# Altium schematic sheet EVK-IRIS-W1-PIN-HEADERS_SDIO-HEADER.SchDoc
size A3; DocumentNumber: 13; SheetNumber: 13; SheetTotal: 14
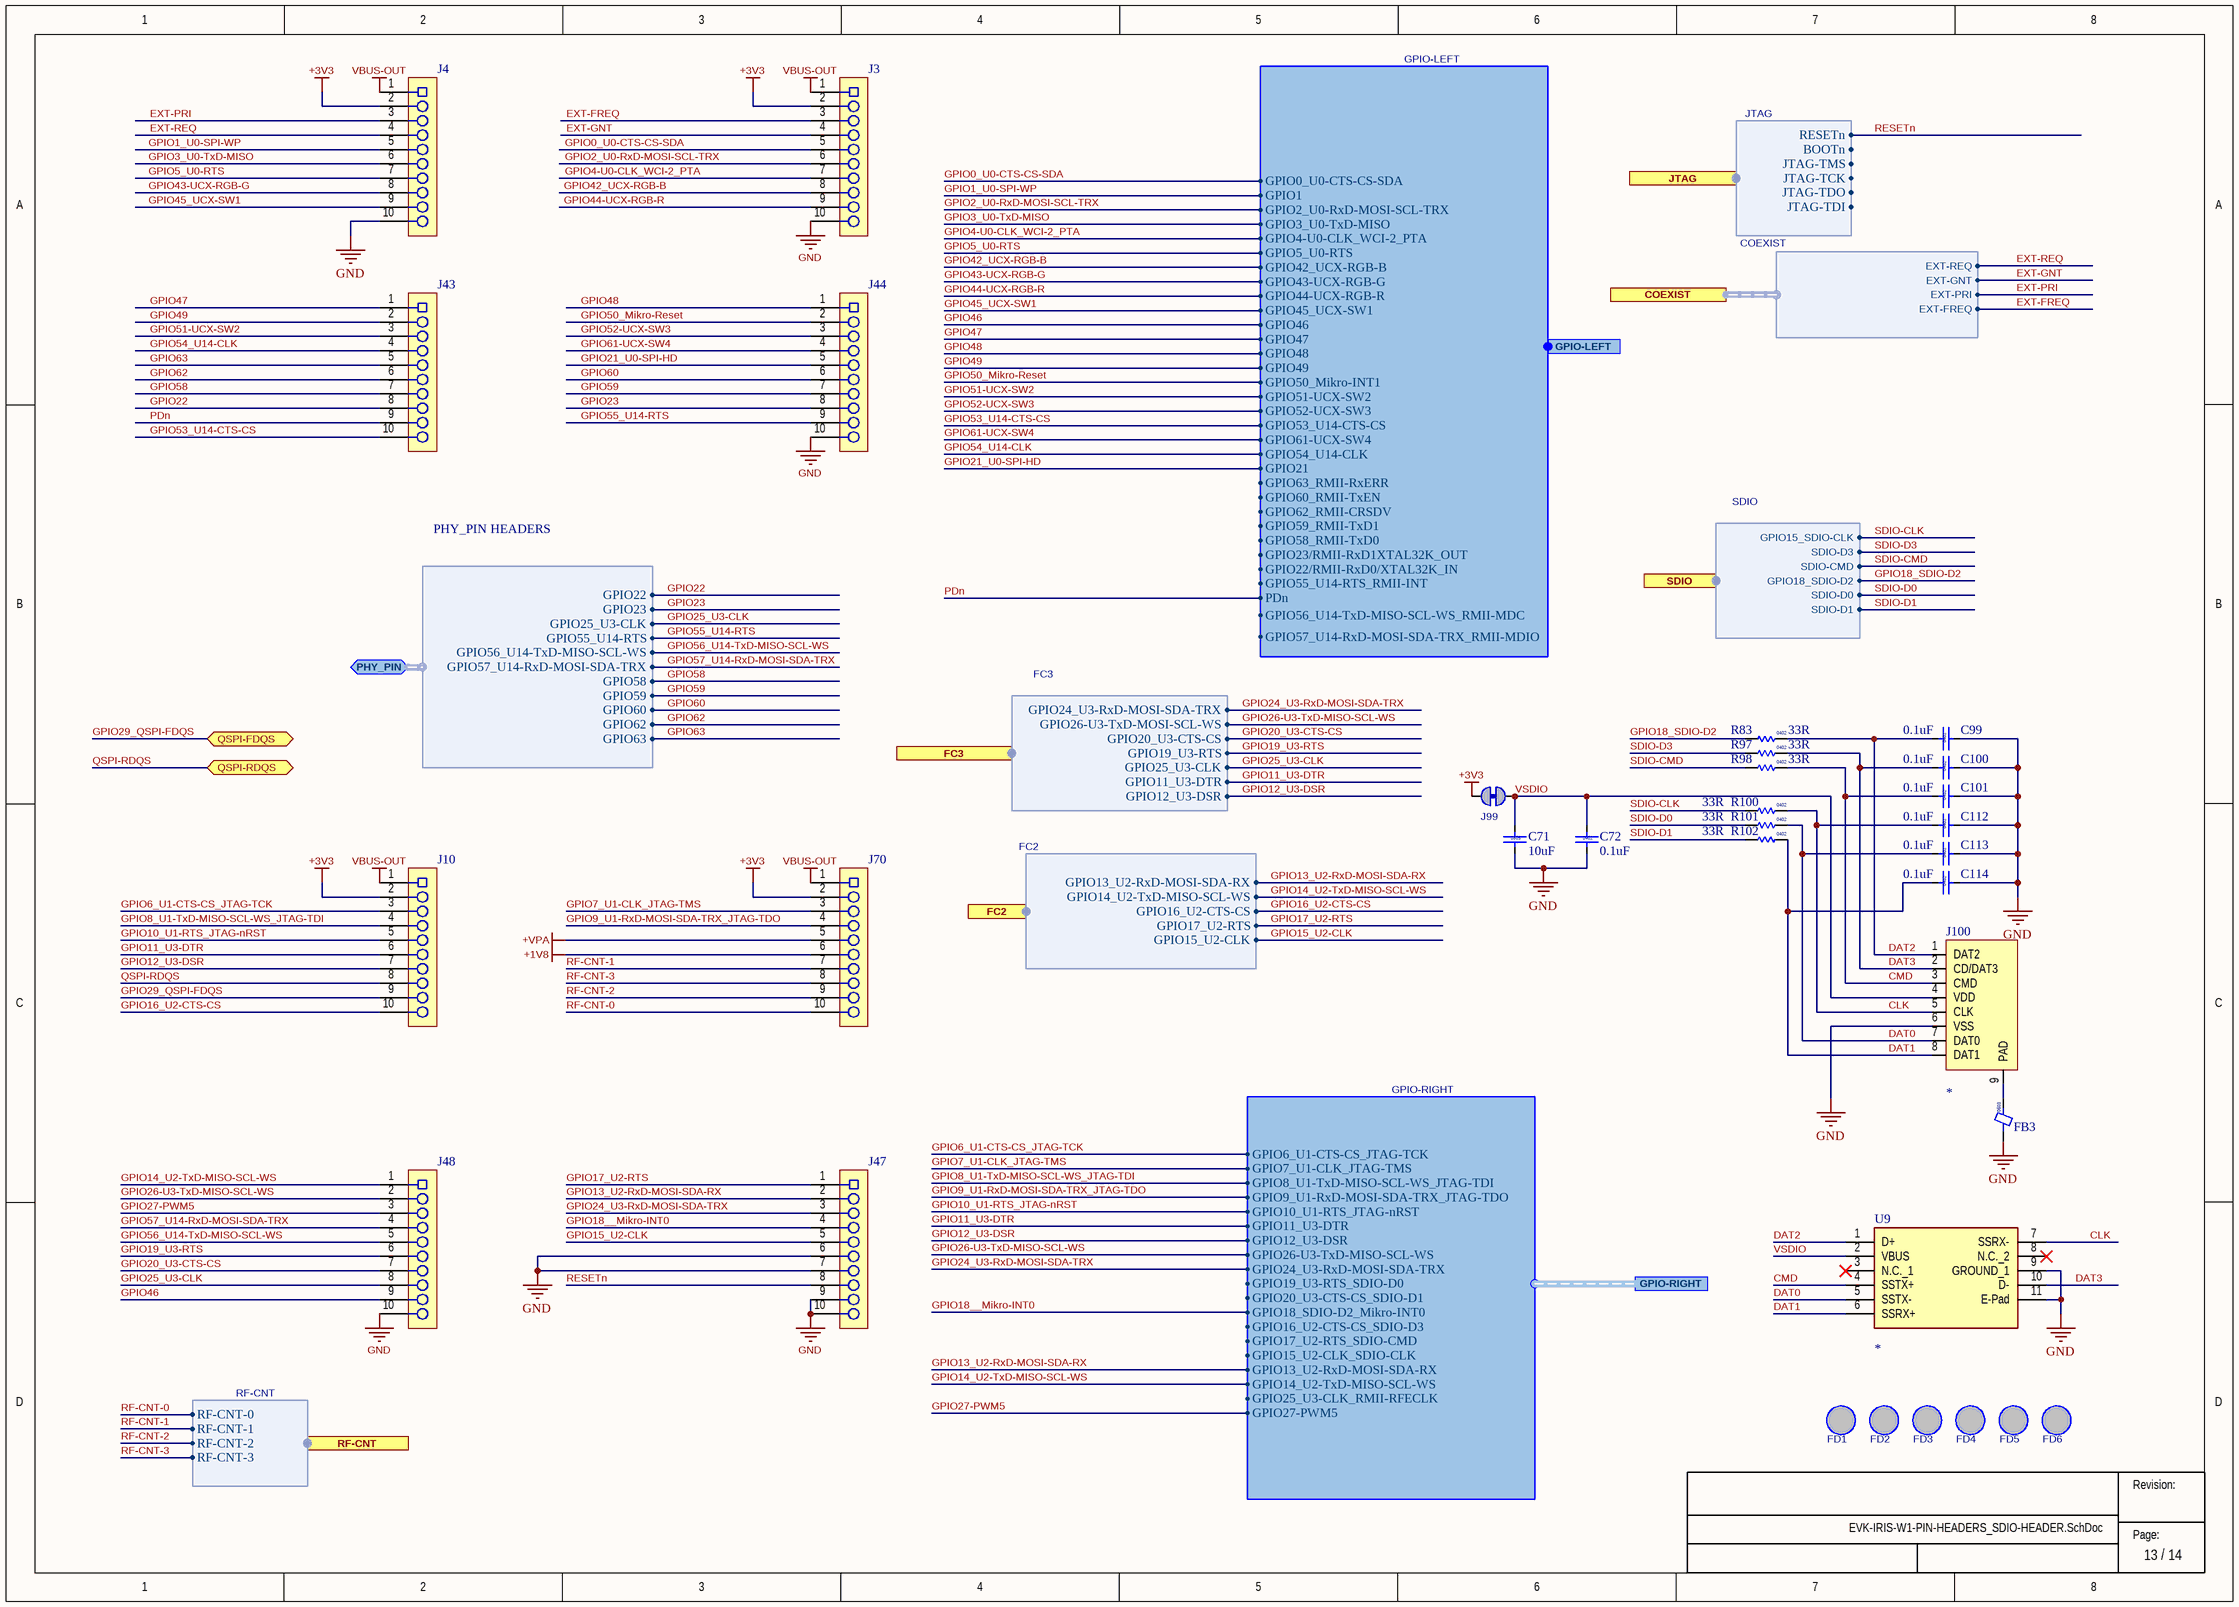
[diagram p0: EVK-IRIS-W1-PIN-HEADERS_SDIO-HEADER.SchDoc]

## Parts
C71  value 10uF  Size: 0805  [Cap 0805 HD]
C72  value 0.1uF  Size: 0402  [Cap 0402 HD]
C99  value 0.1uF  Size: 0402  [Cap 0402 HD]
C100  value 0.1uF  Size: 0402  [Cap 0402 HD]
C101  value 0.1uF  Size: 0402  [Cap 0402 HD]
C112  value 0.1uF  Size: 0402  [Cap 0402 HD]
C113  value 0.1uF  Size: 0402  [Cap 0402 HD]
C114  value 0.1uF  Size: 0402  [Cap 0402 HD]
FB3  Size: 0603  [BLM18EG221SN1]
FD1  Fiducial_1mmDNP  [Fiducial 1mm - Circle]  (value not drawn)  (no BOM)
FD2  Fiducial_1mmDNP  [Fiducial 1mm - Circle]  (value not drawn)  (no BOM)
FD3  Fiducial_1mmDNP  [Fiducial 1mm - Circle]  (value not drawn)  (no BOM)
FD4  Fiducial_1mmDNP  [Fiducial 1mm - Circle]  (value not drawn)  (no BOM)
FD5  Fiducial_1mmDNP  [Fiducial 1mm - Circle]  (value not drawn)  (no BOM)
FD6  Fiducial_1mmDNP  [Fiducial 1mm - Circle]  (value not drawn)  (no BOM)
J3  (no value)  [HDR-0.1P-10PIN-10x1-TH]
J4  (no value)  [HDR-0.1P-10PIN-10x1-TH]
J10  (no value)  [HDR-0.1P-10PIN-10x1-TH]
J43  (no value)  [HDR-0.1P-10PIN-10x1-TH]
J44  (no value)  [HDR-0.1P-10PIN-10x1-TH]
J47  (no value)  [HDR-0.1P-10PIN-10x1-TH]
J48  (no value)  [HDR-0.1P-10PIN-10x1-TH]
J70  (no value)  [HDR-0.1P-10PIN-10x1-TH]
J99  Solderbridge-ShortDNP  [Solderbridge-Short]  (value not drawn)  (net tie, no BOM)
J100  (no value)  [Micro_SD_SKT_SMT_RA]
R83  value 33R  Size: 0402  [RES 0402 HD]
R97  value 33R  Size: 0402  [RES 0402 HD]
R98  value 33R  Size: 0402  [RES 0402 HD]
R100  value 33R  Size: 0402  [RES 0402 HD]
R101  value 33R  Size: 0402  [RES 0402 HD]
R102  value 33R  Size: 0402  [RES 0402 HD]
U9  (no value)  [DFN10]

## Ports
COEXIST (harness COEXIST), FC2 (harness FC2), FC3 (harness FC3), GPIO-LEFT (harness GPIO-LEFT), GPIO-RIGHT (harness GPIO-RIGHT), JTAG (harness JTAG), PHY_PIN (bidir, harness PHY_PIN HEADERS), QSPI-FDQS (bidir), QSPI-RDQS (bidir), RF-CNT (harness RF-CNT), SDIO (harness SDIO)

## Harnesses
GPIO-RIGHT: GPIO6_U1-CTS-CS_JTAG-TCK, GPIO7_U1-CLK_JTAG-TMS, GPIO8_U1-TxD-MISO-SCL-WS_JTAG-TDI, GPIO9_U1-RxD-MOSI-SDA-TRX_JTAG-TDO, GPIO10_U1-RTS_JTAG-nRST, GPIO11_U3-DTR, GPIO12_U3-DSR, GPIO26-U3-TxD-MISO-SCL-WS, GPIO24_U3-RxD-MOSI-SDA-TRX, GPIO19_U3-RTS_SDIO-D0, GPIO20_U3-CTS-CS_SDIO-D1, GPIO18_SDIO-D2_Mikro-INT0, GPIO16_U2-CTS-CS_SDIO-D3, GPIO17_U2-RTS_SDIO-CMD, GPIO15_U2-CLK_SDIO-CLK, GPIO13_U2-RxD-MOSI-SDA-RX, GPIO14_U2-TxD-MISO-SCL-WS, GPIO25_U3-CLK_RMII-RFECLK, GPIO27-PWM5
RF-CNT: RF-CNT-0, RF-CNT-1, RF-CNT-2, RF-CNT-3
GPIO-LEFT: GPIO0_U0-CTS-CS-SDA, GPIO1, GPIO2_U0-RxD-MOSI-SCL-TRX, GPIO3_U0-TxD-MISO, GPIO4-U0-CLK_WCI-2_PTA, GPIO5_U0-RTS, GPIO42_UCX-RGB-B, GPIO43-UCX-RGB-G, GPIO44-UCX-RGB-R, GPIO45_UCX-SW1, GPIO46, GPIO47, GPIO48, GPIO49, GPIO50_Mikro-INT1, GPIO51-UCX-SW2, GPIO52-UCX-SW3, GPIO53_U14-CTS-CS, GPIO61-UCX-SW4, GPIO54_U14-CLK, GPIO21, GPIO63_RMII-RxERR, GPIO60_RMII-TxEN, GPIO62_RMII-CRSDV, GPIO59_RMII-TxD1, GPIO58_RMII-TxD0, GPIO23/RMII-RxD1XTAL32K_OUT, GPIO22/RMII-RxD0/XTAL32K_IN, GPIO55_U14-RTS_RMII-INT, PDn, GPIO56_U14-TxD-MISO-SCL-WS_RMII-MDC, GPIO57_U14-RxD-MOSI-SDA-TRX_RMII-MDIO
COEXIST: EXT-REQ, EXT-GNT, EXT-PRI, EXT-FREQ
SDIO: GPIO15_SDIO-CLK, SDIO-D3, SDIO-CMD, GPIO18_SDIO-D2, SDIO-D0, SDIO-D1
JTAG: JTAG-TCK, JTAG-TDI, JTAG-TDO, JTAG-TMS, BOOTn, RESETn
PHY_PIN HEADERS: GPIO22, GPIO23, GPIO25_U3-CLK, GPIO55_U14-RTS, GPIO56_U14-TxD-MISO-SCL-WS, GPIO57_U14-RxD-MOSI-SDA-TRX, GPIO58, GPIO59, GPIO60, GPIO62, GPIO63
FC2: GPIO13_U2-RxD-MOSI-SDA-RX, GPIO14_U2-TxD-MISO-SCL-WS, GPIO16_U2-CTS-CS, GPIO17_U2-RTS, GPIO15_U2-CLK
FC3: GPIO20_U3-CTS-CS, GPIO19_U3-RTS, GPIO24_U3-RxD-MOSI-SDA-TRX, GPIO26-U3-TxD-MOSI-SCL-WS, GPIO25_U3-CLK, GPIO11_U3-DTR, GPIO12_U3-DSR

## Nets
+1V8: J70.6
+3V3: J3.2 J4.2 J10.2 J70.2 J99.1
+VPA: J70.5
GND: C71.2 C72.2 C99.2 C100.2 C101.2 C112.2 C113.2 C114.2 FB3.1 J3.10 J4.10 J44.10 J47.6 J47.7 J47.9 J47.10 J48.10 J100.6(VSS) U9.9(GROUND_1) U9.11(E-Pad)
VBUS-OUT: J3.1 J4.1 J10.1 J70.1
CLK: C112.1 J100.5(CLK) R100.2 U9.7(SSRX-)
CMD: C101.1 J100.3(CMD) R98.2 U9.4(SSTX+)
DAT0: C113.1 J100.7(DAT0) R101.2 U9.5(SSTX-)
DAT1: C114.1 J100.8(DAT1) R102.2 U9.6(SSRX+)
DAT2: C99.1 J100.1(DAT2) R83.2 U9.1(D+)
DAT3: C100.1 J100.2(CD/DAT3) R97.2 U9.10(D-)
EXT-FREQ: J3.3 ; port COEXIST.EXT-FREQ
EXT-GNT: J3.4 ; port COEXIST.EXT-GNT
EXT-PRI: J4.3 ; port COEXIST.EXT-PRI
EXT-REQ: J4.4 ; port COEXIST.EXT-REQ
GPIO0_U0-CTS-CS-SDA: J3.5 ; port GPIO-LEFT.GPIO0_U0-CTS-CS-SDA
GPIO1_U0-SPI-WP: J4.5 ; port GPIO-LEFT.GPIO1
GPIO2_U0-RxD-MOSI-SCL-TRX: J3.6 ; port GPIO-LEFT.GPIO2_U0-RxD-MOSI-SCL-TRX
GPIO3_U0-TxD-MISO: J4.6 ; port GPIO-LEFT.GPIO3_U0-TxD-MISO
GPIO4-U0-CLK_WCI-2_PTA: J3.7 ; port GPIO-LEFT.GPIO4-U0-CLK_WCI-2_PTA
GPIO5_U0-RTS: J4.7 ; port GPIO-LEFT.GPIO5_U0-RTS
GPIO6_U1-CTS-CS_JTAG-TCK: J10.3 ; port GPIO-RIGHT.GPIO6_U1-CTS-CS_JTAG-TCK
GPIO7_U1-CLK_JTAG-TMS: J70.3 ; port GPIO-RIGHT.GPIO7_U1-CLK_JTAG-TMS
GPIO8_U1-TxD-MISO-SCL-WS_JTAG-TDI: J10.4 ; port GPIO-RIGHT.GPIO8_U1-TxD-MISO-SCL-WS_JTAG-TDI
GPIO9_U1-RxD-MOSI-SDA-TRX_JTAG-TDO: J70.4 ; port GPIO-RIGHT.GPIO9_U1-RxD-MOSI-SDA-TRX_JTAG-TDO
GPIO10_U1-RTS_JTAG-nRST: J10.5 ; port GPIO-RIGHT.GPIO10_U1-RTS_JTAG-nRST
GPIO11_U3-DTR: J10.6 ; port GPIO-RIGHT.GPIO11_U3-DTR, port FC3.GPIO11_U3-DTR
GPIO12_U3-DSR: J10.7 ; port GPIO-RIGHT.GPIO12_U3-DSR, port FC3.GPIO12_U3-DSR
GPIO13_U2-RxD-MOSI-SDA-RX: J47.2 ; port GPIO-RIGHT.GPIO13_U2-RxD-MOSI-SDA-RX, port FC2.GPIO13_U2-RxD-MOSI-SDA-RX
GPIO14_U2-TxD-MISO-SCL-WS: J48.1 ; port GPIO-RIGHT.GPIO14_U2-TxD-MISO-SCL-WS, port FC2.GPIO14_U2-TxD-MISO-SCL-WS
GPIO15_U2-CLK: J47.5 ; port FC2.GPIO15_U2-CLK
GPIO16_U2-CTS-CS: J10.10 ; port FC2.GPIO16_U2-CTS-CS
GPIO17_U2-RTS: J47.1 ; port FC2.GPIO17_U2-RTS
GPIO18__Mikro-INT0: J47.4 ; port GPIO-RIGHT.GPIO18_SDIO-D2_Mikro-INT0
GPIO18_SDIO-D2: R83.1 ; port SDIO.GPIO18_SDIO-D2
GPIO19_U3-RTS: J48.6 ; port FC3.GPIO19_U3-RTS
GPIO20_U3-CTS-CS: J48.7 ; port FC3.GPIO20_U3-CTS-CS
GPIO21_U0-SPI-HD: J44.5 ; port GPIO-LEFT.GPIO21
GPIO22: J43.8 ; port PHY_PIN.GPIO22
GPIO23: J44.8 ; port PHY_PIN.GPIO23
GPIO24_U3-RxD-MOSI-SDA-TRX: J47.3 ; port GPIO-RIGHT.GPIO24_U3-RxD-MOSI-SDA-TRX, port FC3.GPIO24_U3-RxD-MOSI-SDA-TRX
GPIO25_U3-CLK: J48.8 ; port PHY_PIN.GPIO25_U3-CLK, port FC3.GPIO25_U3-CLK
GPIO26-U3-TxD-MISO-SCL-WS: J48.2 ; port GPIO-RIGHT.GPIO26-U3-TxD-MISO-SCL-WS, port FC3.GPIO26-U3-TxD-MOSI-SCL-WS
GPIO27-PWM5: J48.3 ; port GPIO-RIGHT.GPIO27-PWM5
GPIO29_QSPI-FDQS: J10.9 ; port QSPI-FDQS
GPIO42_UCX-RGB-B: J3.8 ; port GPIO-LEFT.GPIO42_UCX-RGB-B
GPIO43-UCX-RGB-G: J4.8 ; port GPIO-LEFT.GPIO43-UCX-RGB-G
GPIO44-UCX-RGB-R: J3.9 ; port GPIO-LEFT.GPIO44-UCX-RGB-R
GPIO45_UCX-SW1: J4.9 ; port GPIO-LEFT.GPIO45_UCX-SW1
GPIO46: J48.9 ; port GPIO-LEFT.GPIO46
GPIO47: J43.1 ; port GPIO-LEFT.GPIO47
GPIO48: J44.1 ; port GPIO-LEFT.GPIO48
GPIO49: J43.2 ; port GPIO-LEFT.GPIO49
GPIO50_Mikro-Reset: J44.2 ; port GPIO-LEFT.GPIO50_Mikro-INT1
GPIO51-UCX-SW2: J43.3 ; port GPIO-LEFT.GPIO51-UCX-SW2
GPIO52-UCX-SW3: J44.3 ; port GPIO-LEFT.GPIO52-UCX-SW3
GPIO53_U14-CTS-CS: J43.10 ; port GPIO-LEFT.GPIO53_U14-CTS-CS
GPIO54_U14-CLK: J43.4 ; port GPIO-LEFT.GPIO54_U14-CLK
GPIO55_U14-RTS: J44.9 ; port PHY_PIN.GPIO55_U14-RTS
GPIO56_U14-TxD-MISO-SCL-WS: J48.5 ; port PHY_PIN.GPIO56_U14-TxD-MISO-SCL-WS
GPIO57_U14-RxD-MOSI-SDA-TRX: J48.4 ; port PHY_PIN.GPIO57_U14-RxD-MOSI-SDA-TRX
GPIO58: J43.7 ; port PHY_PIN.GPIO58
GPIO59: J44.7 ; port PHY_PIN.GPIO59
GPIO60: J44.6 ; port PHY_PIN.GPIO60
GPIO61-UCX-SW4: J44.4 ; port GPIO-LEFT.GPIO61-UCX-SW4
GPIO62: J43.6 ; port PHY_PIN.GPIO62
GPIO63: J43.5 ; port PHY_PIN.GPIO63
PDn: J43.9 ; port GPIO-LEFT.PDn
QSPI-RDQS: J10.8 ; port QSPI-RDQS
RESETn: J47.8 ; port JTAG.RESETn
RF-CNT-0: J70.10 ; port RF-CNT.RF-CNT-0
RF-CNT-1: J70.7 ; port RF-CNT.RF-CNT-1
RF-CNT-2: J70.9 ; port RF-CNT.RF-CNT-2
RF-CNT-3: J70.8 ; port RF-CNT.RF-CNT-3
SDIO-CLK: R100.1 ; port SDIO.GPIO15_SDIO-CLK
SDIO-CMD: R98.1 ; port SDIO.SDIO-CMD
SDIO-D0: R101.1 ; port SDIO.SDIO-D0
SDIO-D1: R102.1 ; port SDIO.SDIO-D1
SDIO-D3: R97.1 ; port SDIO.SDIO-D3
VSDIO: C71.1 C72.1 J99.2 J100.4(VDD) U9.2(VBUS)
NetFB3_2: FB3.2 J100.9(PAD)

Not connected (* = marked no-connect by the designer): U9 3(N.C._1)* 8(N.C._2)*

## Notes on the sheet
- Revision:
- Page:

## Library data of the parts
C71 = 120-00133: Capacitor, Ceramic, 10uF 16V 10% X7R, 0805; Manufacturer 1: Samsung Electro-Mechanics America, Inc.; Manufacturer Part Number 1: CL21B106KOQNNNE; Part Name: CAP CER 10uF 16V 10% X7R 0805; Item Phase: Pre-Production; Tolerance: +/- 10%; Use in new designs: Yes; UBX Code: None; Part Number: 120-00133; Supplier 1: Digi-Key; Supplier Part Number 1: 1276-2872-1-ND; Manufacturer 2: Yageo; Manufacturer Part Number 2: CC0805KKX7R7BB106; Supplier 2: Digi-Key; Supplier Part Number 2: 311-3501-2-ND; Height: 1.40mm; Max Operating Temp: 125; Min Operating Temp: -55; Pins: 2; Revision: 1; Temperature Coefficient: X7R; Voltage: 16V
C72 C99-C101 C112-C114 = 120-00077: Cap, Ceramic 0.1uF 16V 10% X7R 0402.; Manufacturer 1: Murata Electronics North America; Manufacturer Part Number 1: GRM155R71C104KA88D; Part Name: CAP CER 0.1uF 16V 10% X7R 0402; Item Phase: In Production; Tolerance: +/- 10%; Use in new designs: Yes; UBX Code: None; Part Number: 120-00077; Supplier 1: Digi-Key; Supplier Part Number 1: 490-3261-1-ND; Manufacturer 2: AVX Corporation; Manufacturer Part Number 2: 0402YC104KAT2A; Supplier 2: Digi-Key; Supplier Part Number 2: 478-7888-1-ND; Height: 0.55mm; Max Operating Temp: 125; Min Operating Temp: -55; Pins: 2; Revision: 0C; Temperature Coefficient: X7R; Voltage: 16V
FB3 = BLM18EG221SN1: Ferrite Bead, 220ohm @ 100MHz, 2A, 0603; Manufacturer 1: Murata Electronics North America; Manufacturer Part Number 1: BLM18EG221SN1D; Part Name: Ferrite Bead 220ohm 2A 0503; Body Size: None; Item Phase: Unreleased; Use in new designs: Yes; Value: None; Part Number: BLM18EG221SN1; Supplier 1: Digi-Key; Supplier Part Number 1: 490-3992-2-ND; Current: 2A; Height: 0.8mm; MFG Package: None; Max Operating Temp: 85; Min Operating Temp: -55; Pins: None; Revision: None; Voltage: None; Manufacturer 2: None; Manufacturer Part Number 2: None; Supplier 2: None; Supplier Part Number 2: None; UBX Code: None
FD1-FD6 = Fiducial_1mm_Circle: 1mm Fiducial Target; Added By: EMOO; Part Number: Fiducial_1mm; Height: 0; DNP: DNP; Added Date: 12/12/2020
J3 J4 J10 J43 J44 J47 J48 J70 = 130-00046: Header, 0.100" Pitch, 10Pin, 10x1, Through Hole; Part Name: CON Header 0.1in 10Pin 1Row TH; Manufacturer 1: FCI; Manufacturer Part Number 1: 68002-210HLF; Use in new designs: Yes; Item Phase: Unreleased; Voltage: None; Part Number: 130-00046; Height: 0.32"; Pins: 10; Diameter: None; Max Operating Temp: None; Min Operating Temp: None; Revision: None; UBX Code: None; Manufacturer 2: None; Supplier 1: Digi-Key; Supplier Part Number 1: 609-3301-ND; Manufacturer Part Number 2: None; Supplier 2: None; Supplier Part Number 2: None; Manufacturer P/N: *
J99 = Solderbridge-Short: Added By: Paul B; Part Number: Solderbridge-Short; Height: 0; DNP: DNP; Added Date: 12/2/2015
J100 = 130-00062: Micro SD Card Socket, Right Angle, with 4 Ground Pads, SMT; Manufacturer 1: Molex Inc; Manufacturer Part Number 1: 0472192001; Part Name: CON Micro SD 1.1mm 8Pin 1Row SMT RA; Item Phase: In Production; Use in new designs: Yes; Voltage: None; Manufacturer P/N: *; Part Number: 130-00062; Supplier 1: Digi-Key; Supplier Part Number 1: WM6698CT-ND; Diameter: None; Height: 1.9mm; Max Operating Temp: None; Min Operating Temp: None; Pins: 8; Revision: 0A; UBX Code: None; Manufacturer 2: None; Manufacturer Part Number 2: None; Supplier 2: None; Supplier Part Number 2: None
R83 R97 R98 R100-R102 = UBXH18-0008013: RES THICK FILM CHIP 0402 33R 5% 50V 63mW; Manufacturer: KOA; Manufacturer P/N: RK73B1ETTP330J; Editor: matej.budin; Env: ROHS; Permitted Use: Volume Products; Perferred: PREF; Mfg P/N Status: Active; Mfg P/N Split: 100; Mfg P/N Released: Yes; Released by: erian.bezhani; Part Number: UBXH18-0008013; Tolerance: 5%; Max Power: 63mW; Part Type: Resistor; UBX Wiki: https://wiki.u-blox.com/bin/view/Operations/PartDetails?index=6887; RefDes: R; Max Voltage: 50V; Release Data: 2013-01-10T15:04:42; Mfg P/N Datasheet: https://wiki.u-blox.com/bin/view/Generic/Docs/DocumentSummary?index=18259
U9 = CDDFN10-0516P: 4.5V, 7.2V Clamp 4A (8/20µs) Ipp Tvs Diode Surface Mount 10-DFN (4.1x2); Mfr_Name: BOURNS; RefDes: RefDes; Type: Type; Manufacturer P/N: *